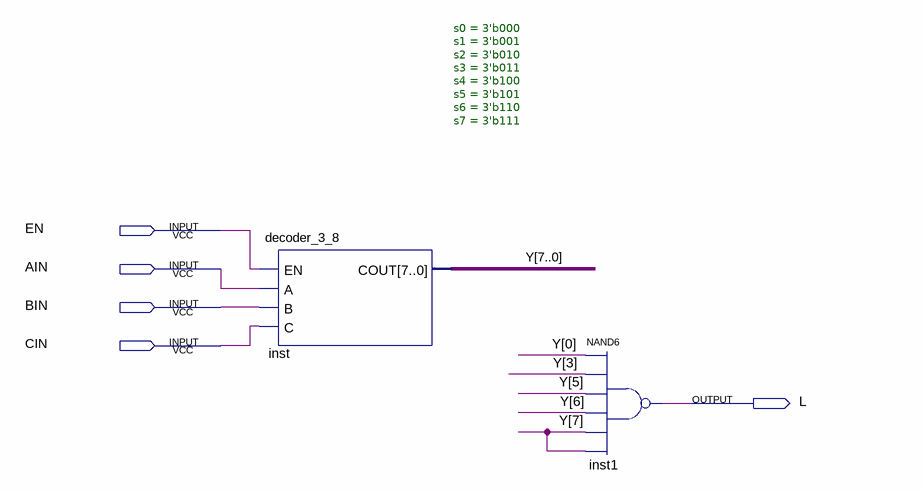
[diagram p0: schematic sheet]
// Quartus schematic traffic_Monitor.bdf as structural Verilog: 2 symbols, 5 pins
module traffic_Monitor (
  input  EN,
  input  AIN,
  input  BIN,
  input  CIN,
  output L
);

  wire [7:0] Y;

  decoder_3_8 #(.s0(3'b000), .s1(3'b001), .s2(3'b010), .s3(3'b011), .s4(3'b100), .s5(3'b101), .s6(3'b110), .s7(3'b111)) inst (
    .EN(EN), .A(AIN), .B(BIN), .C(CIN), .COUT(Y));
  nand inst1 (L, Y[0], Y[3], Y[5], Y[6], Y[7], Y[7]);
endmodule
